# EasyEDA schematic power_distributer.json
TITLE: Sheet_1; REV: 1.0; Date: 2023-02-25; Sheet: 1/1; Company: Your Company
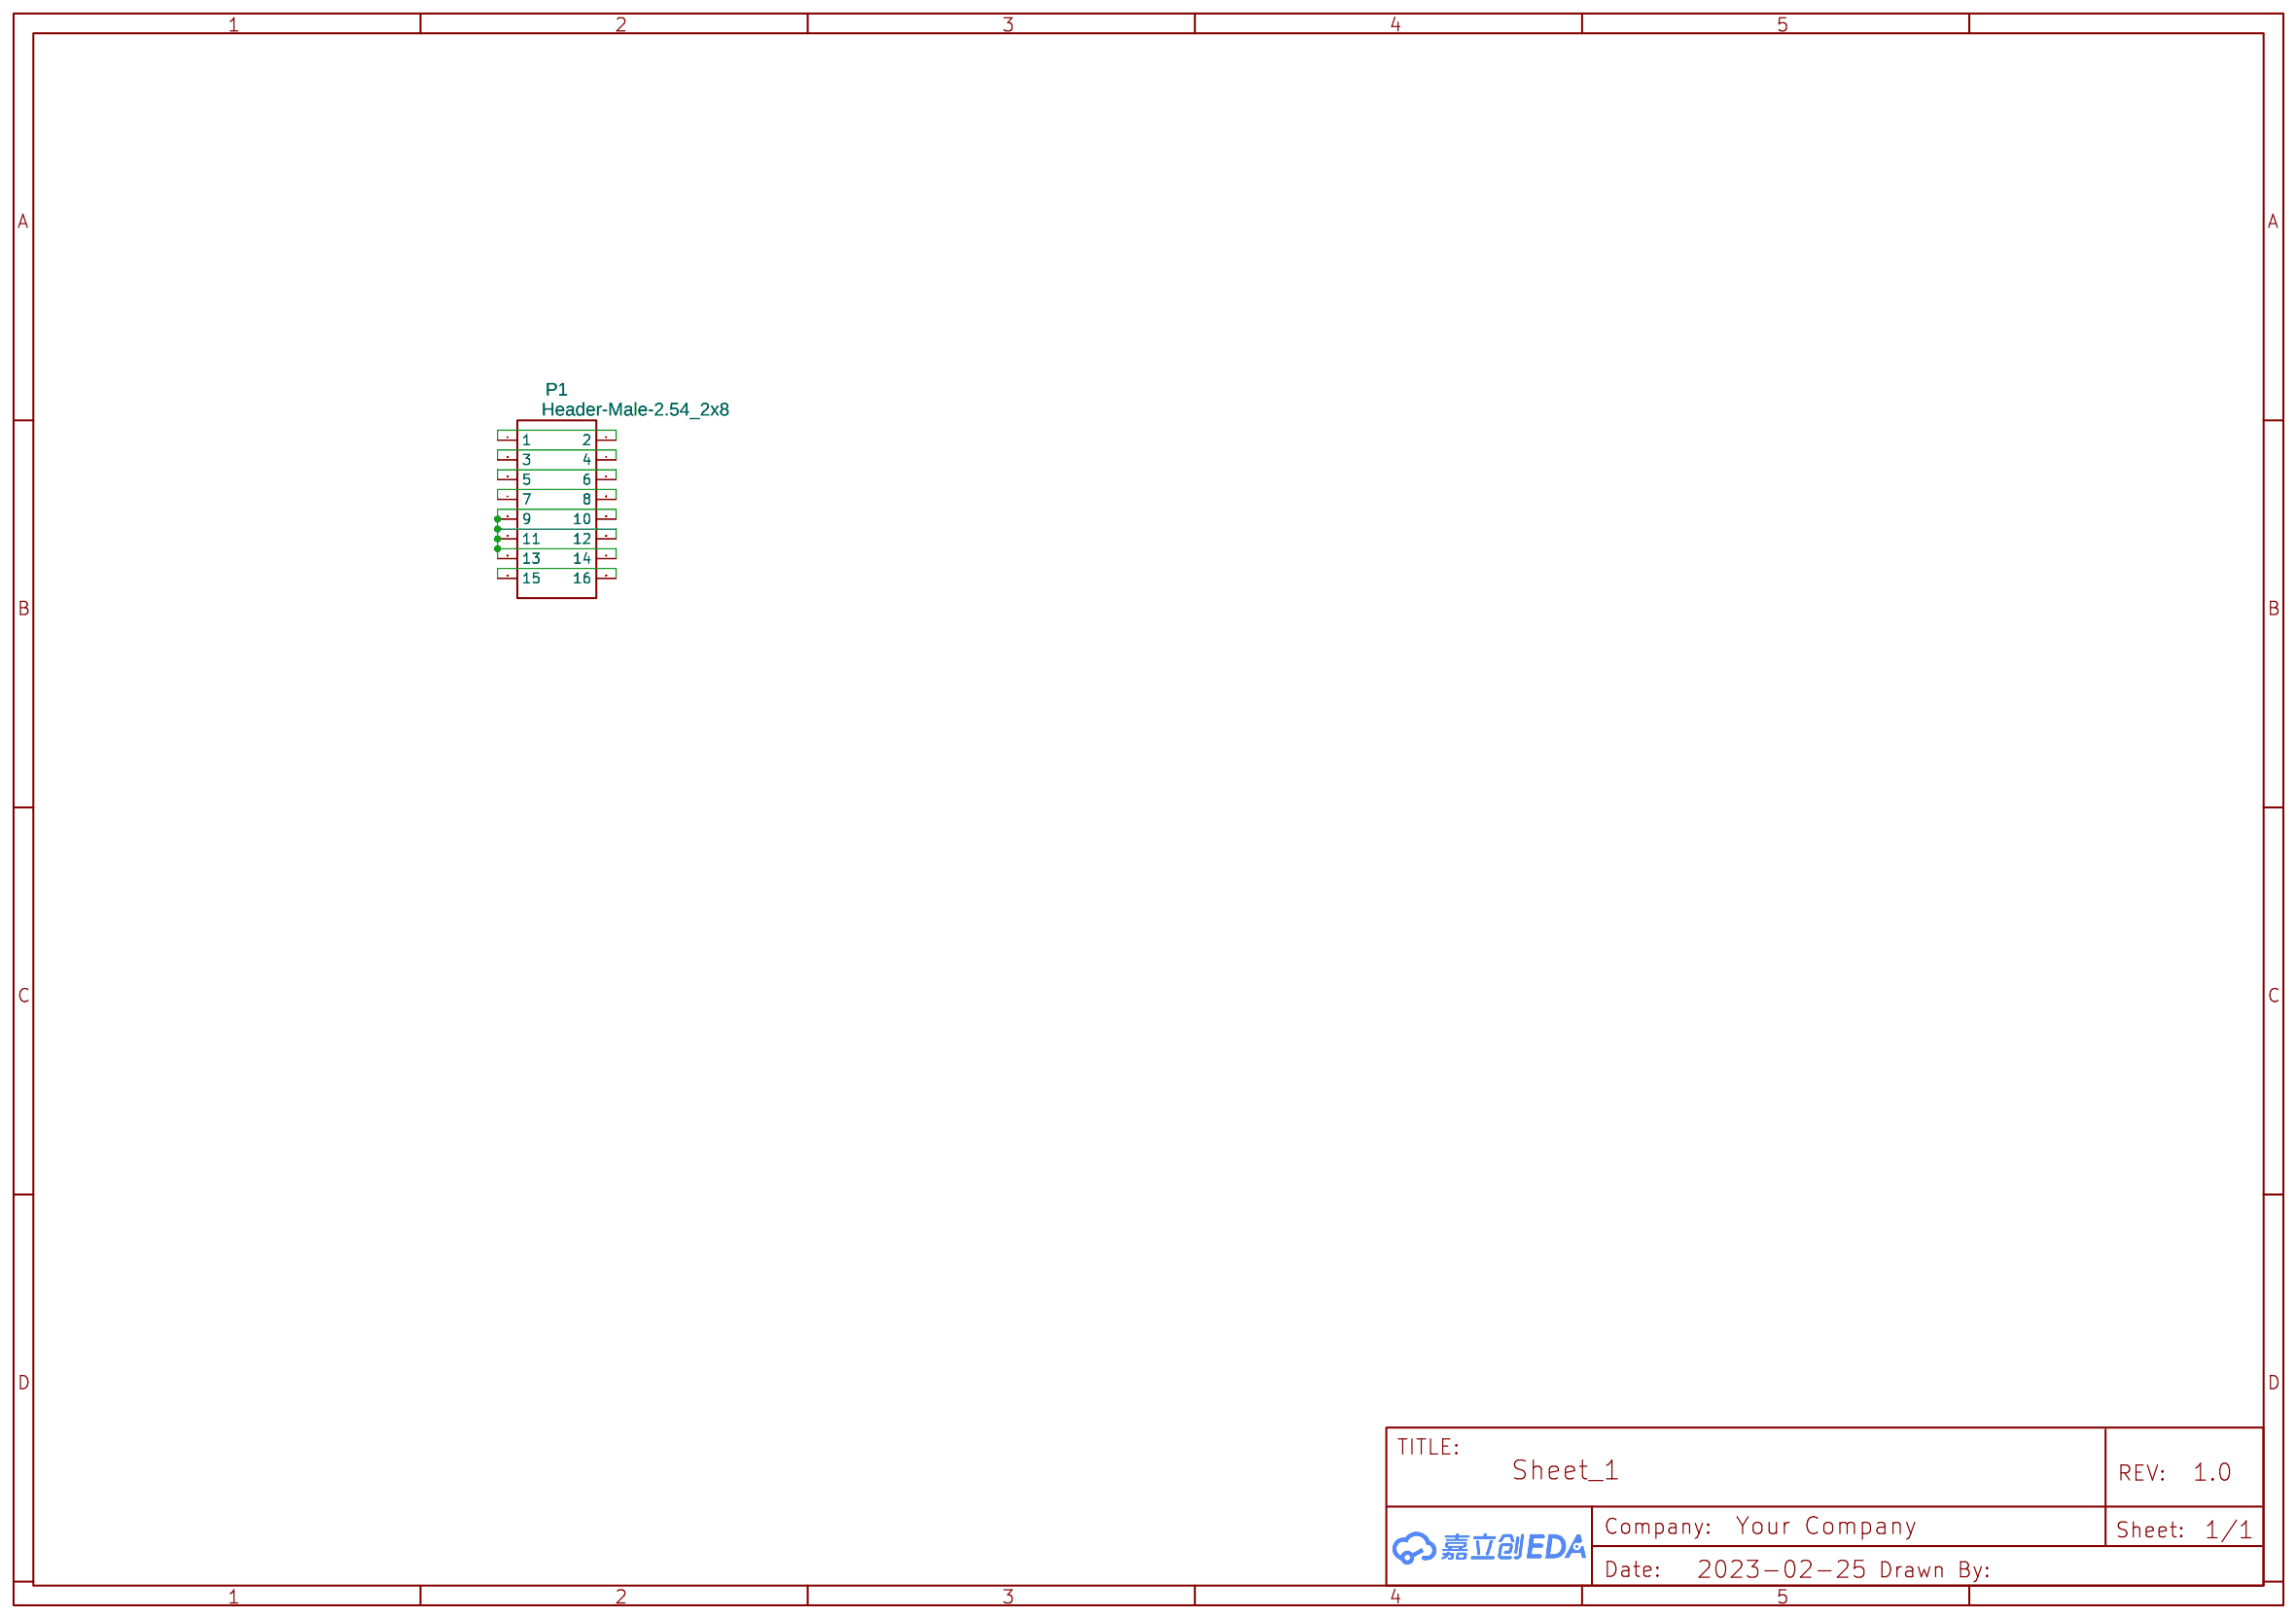
[diagram p0: schematic sheet]

## Parts
P1  Header-Male-2.54_2x8  [HDR-TH_16P-P2.54-V-M-R2-C8-S2.54]

## Library data of the parts
P1 = Header-Male-2.54_2x8: Supplier: LCSC; Manufacturer: BOOMELE(博穆精密); Manufacturer Part: 2.54-2*8P针; Supplier Part: C68234; JLCPCB Part Class: Extended Part

## Nets
Net-(P1-1): P1.1 P1.2
Net-(P1-3): P1.3 P1.4
Net-(P1-5): P1.5 P1.6
Net-(P1-7): P1.7 P1.8
Net-(P1-9): P1.9 P1.10 P1.11 P1.12 P1.13 P1.14
Net-(P1-15): P1.15 P1.16
